# EAGLE design rotenc (EAGLE 9.1.0)
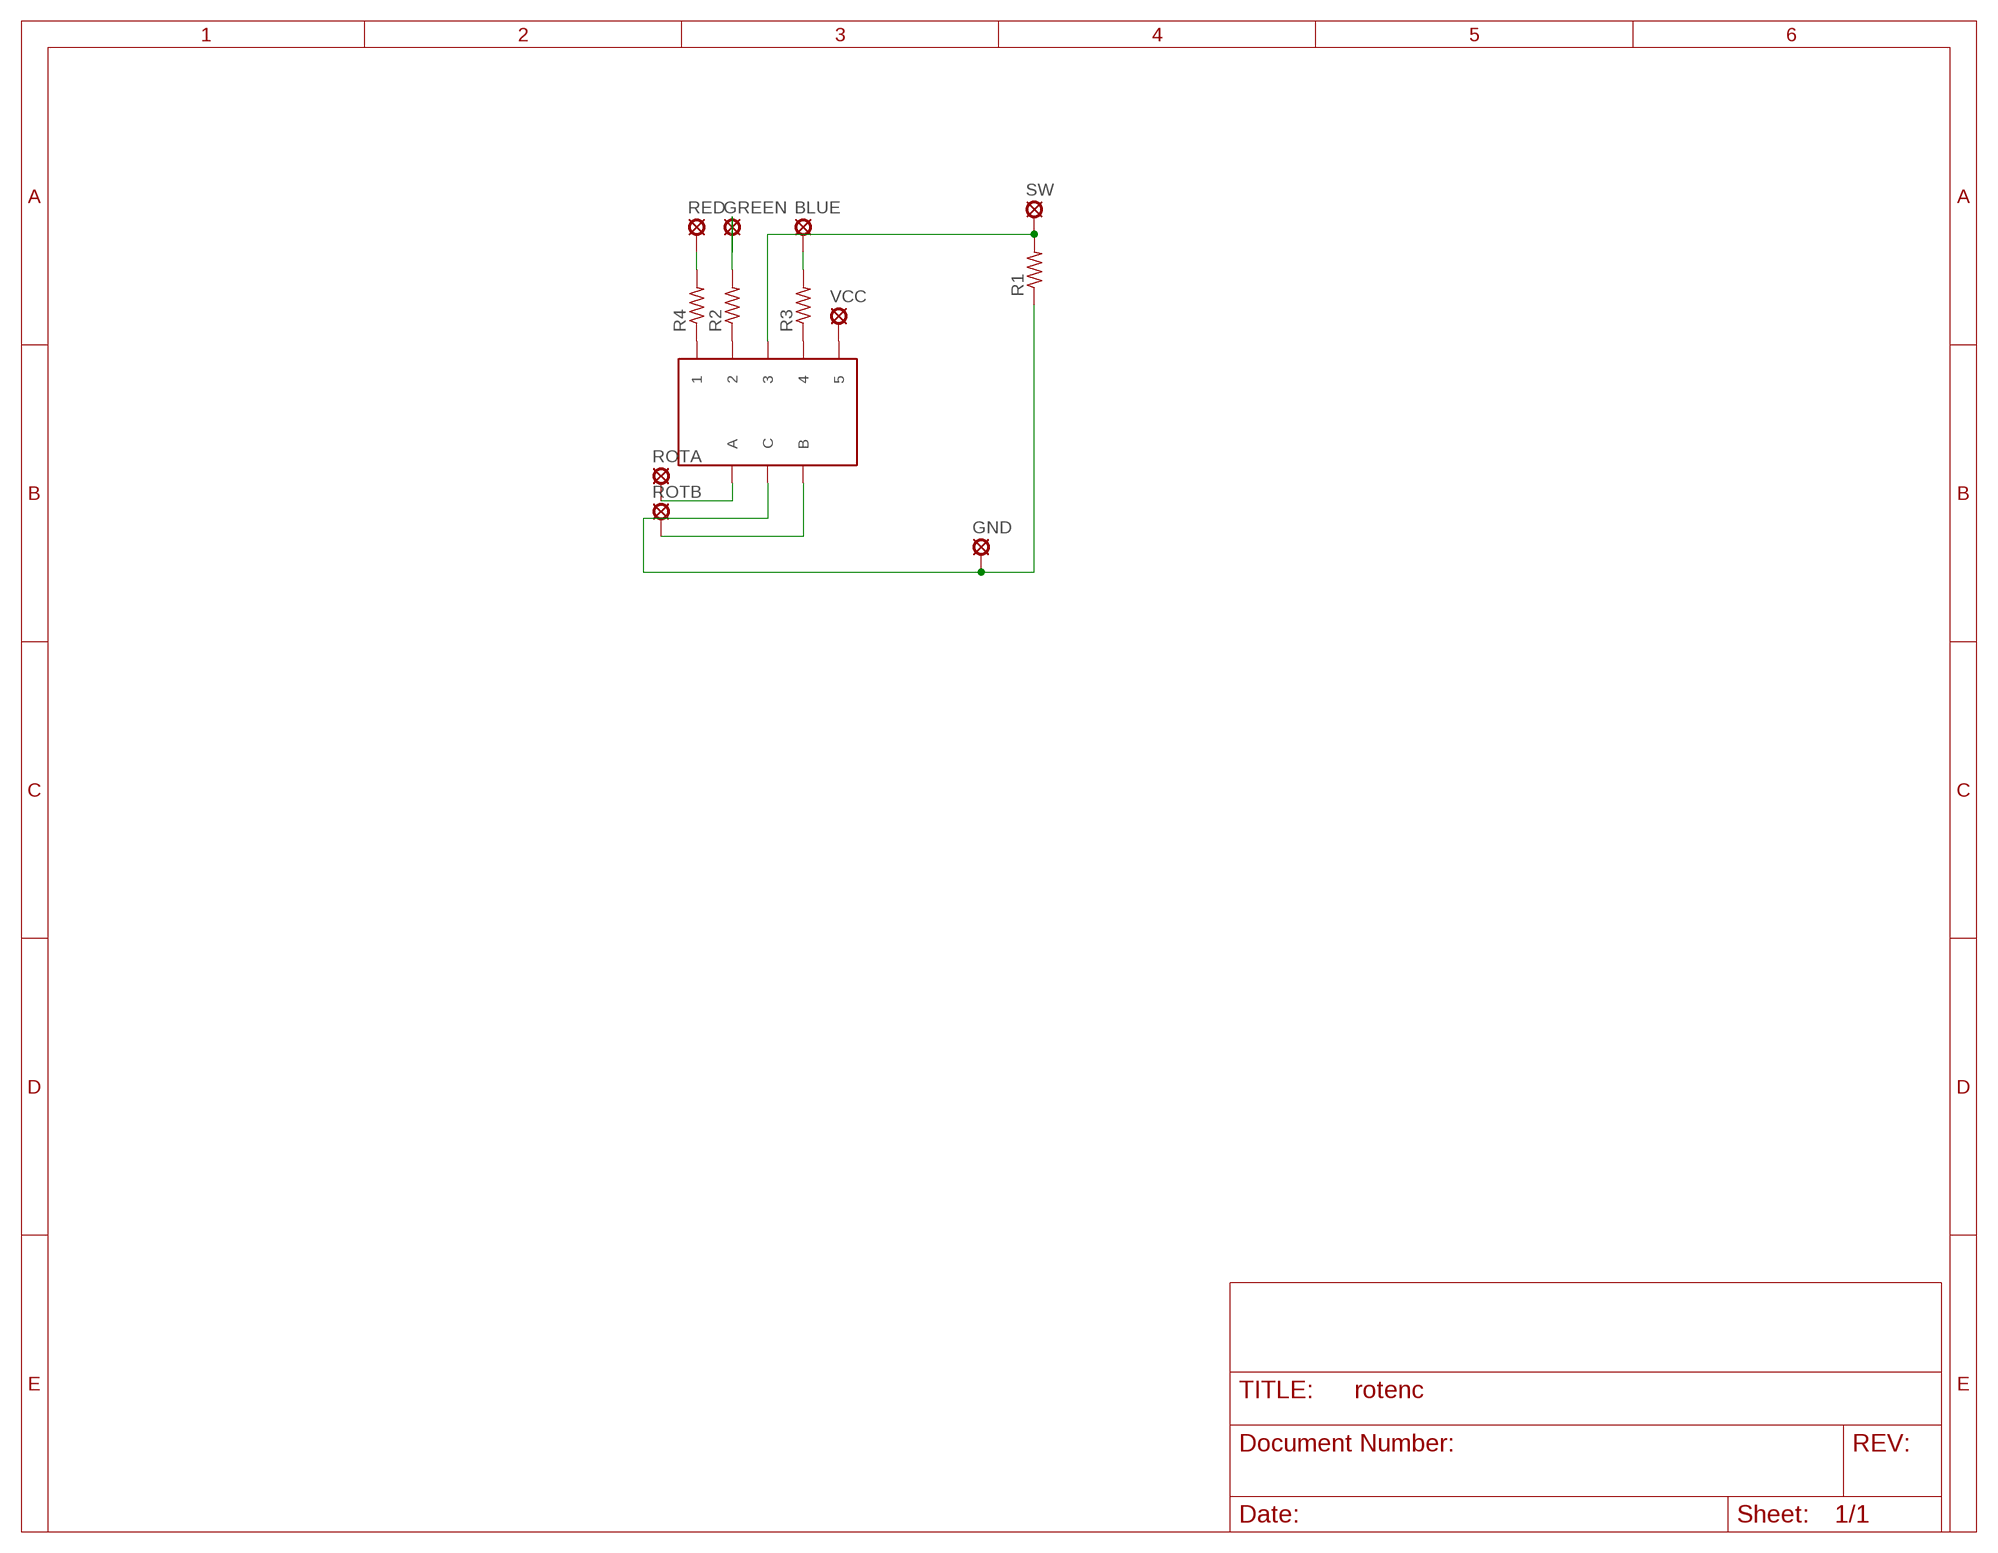
[diagram p0: schematic, sheet 1]

## Parts
BLUE  SE13  [SE13]
GND  SE13  [SE13]
GREEN  SE13  [SE13]
R1  R-US_0207/7  [0207/7]
R2  R-US_0207/7  [0207/7]
R3  R-US_0207/7  [0207/7]
R4  R-US_0207/7  [0207/7]
RED  SE13  [SE13]
ROTA  SE13  [SE13]
ROTB  SE13  [SE13]
SW  SE13  [SE13]
U$1  EC12PLRGB  [EL1296RGB]
VCC  SE13  [SE13]

## Nets
BLUE: BLUE.MP R3.2
GREEN: GREEN.MP R2.2
N$1: R2.1 U$1.2
N$2: R4.1 U$1.1
N$3: R3.1 U$1.4
N$4: U$1.5 VCC.MP
N$5: GND.MP R1.1 U$1.C
RED: R4.2 RED.MP
ROTA: ROTA.MP U$1.A
ROTB: ROTB.MP U$1.B
SW: R1.2 SW.MP U$1.3

## Library data of the parts
BLUE GND GREEN RED ROTA ROTB SW VCC = solpad:SE13: SOLDER PAD E1542, drill 1,3mm, distributor Buerklin, 07F815
R1-R4 = resistor:R-US_: RESISTOR, American symbol
U$1 = EC12:EC12PLRGB

## Board
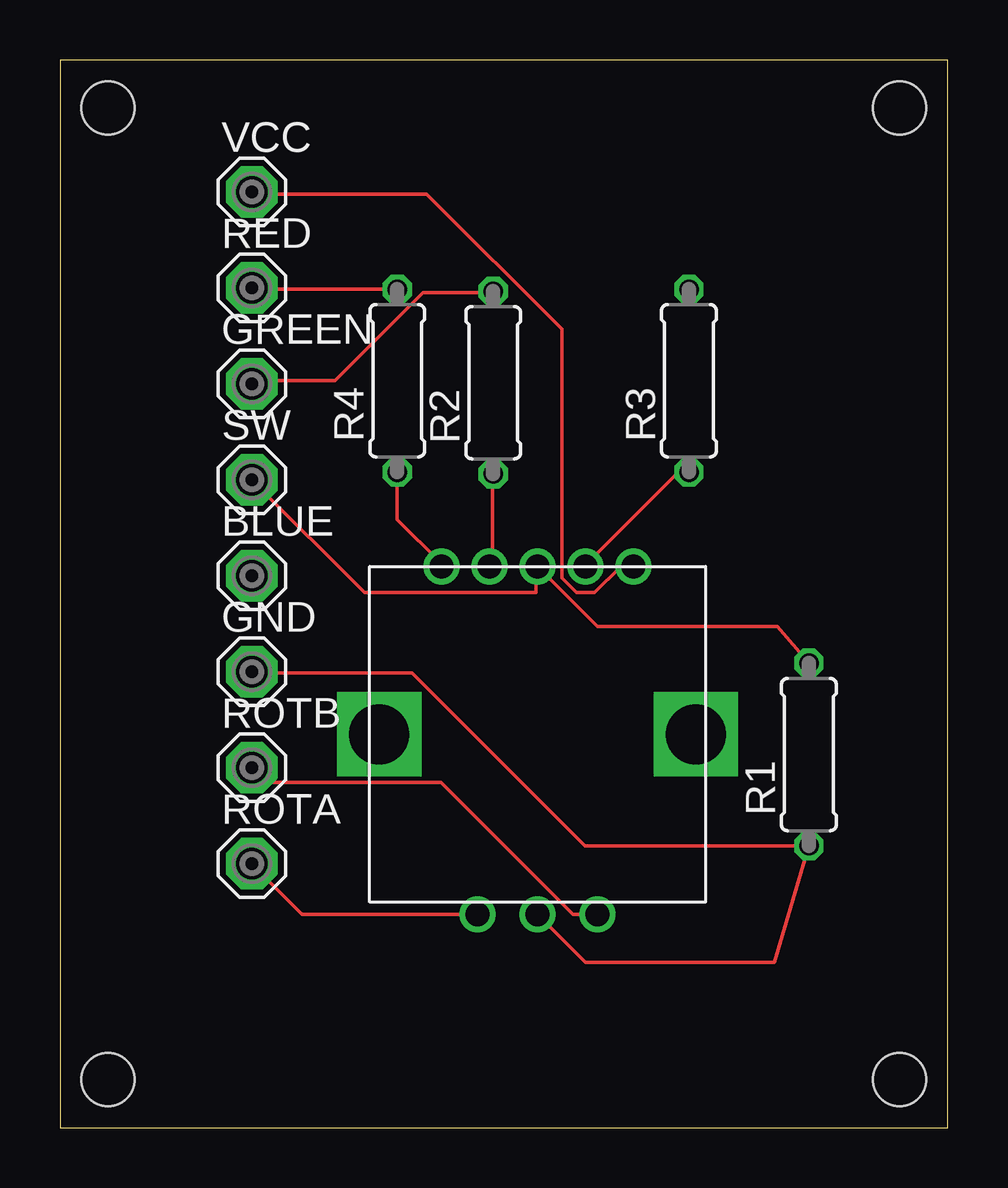
[diagram p1: board, top side]
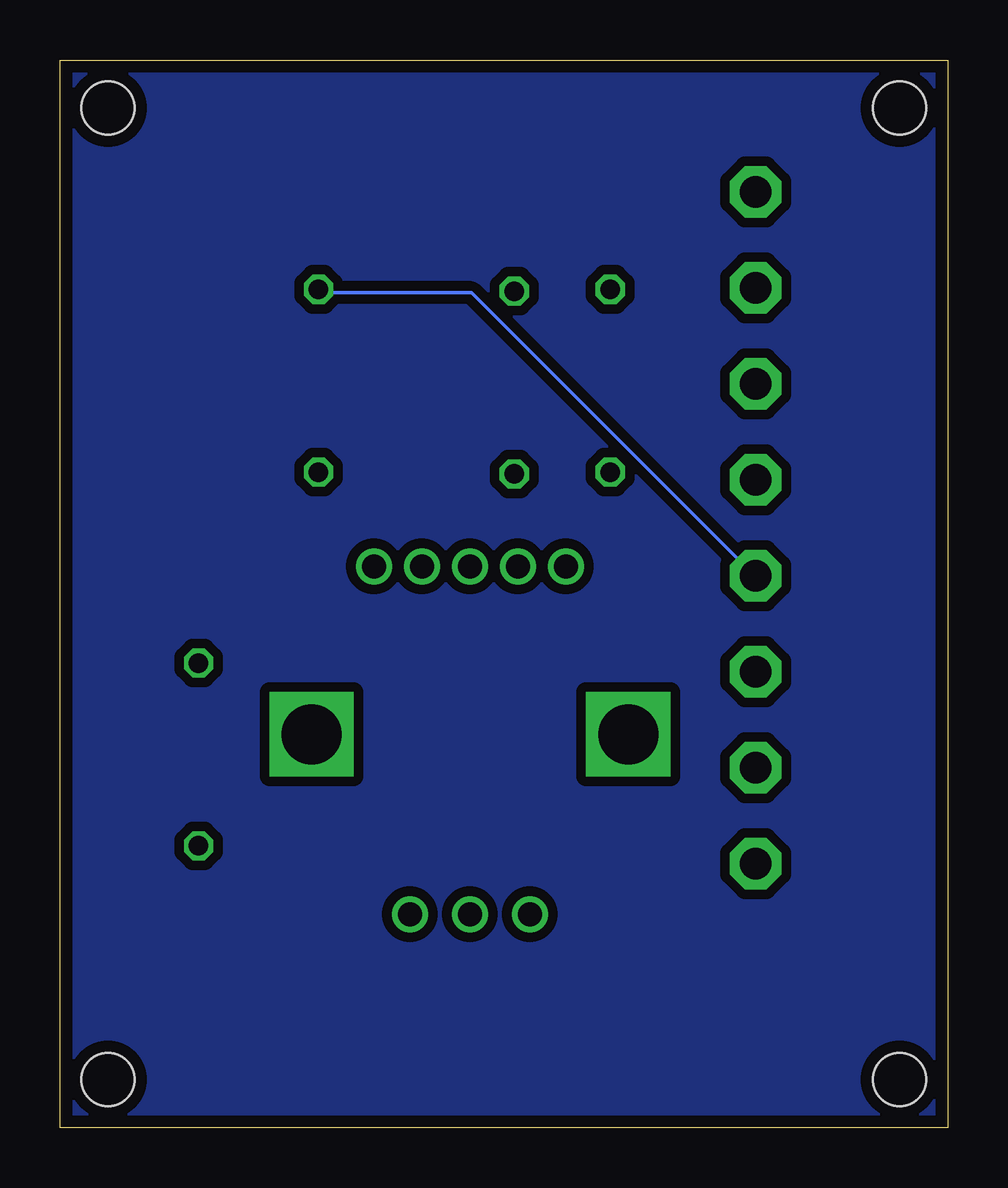
[diagram p2: board, bottom side, seen from below]

Size 37 x 44.5 mm. Coordinates in mm from the lower left corner, seen from the top.
Outline: 0,0 37,0 37,44.5 0,44.5 0,0
Copper layers (1*16): Top 0.035mm / dielectric 1.6mm / Bottom 0.035mm
Design rules "Elecrow_2-layer_PCB_eagle_rule": minimum track width 6mil, minimum drill 12mil, track to track 6mil, track to pad 6mil, pad to pad 6mil, via to via 8mil, smd to smd 0mil, copper to edge 20mil, drill to drill 10mil, minimum pad ring 6mil, minimum via ring 6mil, stop-mask expansion 0mil, vias tented up to drill 100mil, thermal gap 10mil
Holes 2.2 mm at 2,42.5 2,2 35,2 35,42.5

### Footprints (pad centres in the part's own frame; a part is rotated, then mirrored left to right if it is on the bottom)
SE13 = drill 1.321 pad 2.159 octagon: MP 0,0
0207/7 = drill 0.813 octagon: 1 -3.81,0; 2 3.81,0
EL1296RGB = drill 1: 1 -4,7; 2 -2,7; 3 0,7; 4 2,7; 5 4,7; A -2.5,-7.5; B 2.5,-7.5; C 0,-7.5 | drill 2.5 square: HOUSING1 6.6,0; HOUSING2 -6.6,0

### Placement (x,y rotation side)
BLUE  8,23 0 top
GND  8,19 0 top
GREEN  8,31 0 top
R1  31.22,15.55 90 top
R2  18.06,31.05 90 top
R3  26.22,31.13 90 top
R4  14.06,31.13 90 top
RED  8,35 0 top
ROTA  8,11 0 top
ROTB  8,15 0 top
SW  8,27 0 top
U$1  19.91,16.39 0 top
VCC  8,39 0 top

### Tracks (layer width: path | path; a pad name or v marks a point on that pad's centre or on a via)
BLUE
  Bottom 0.152: R3.2 26.1,34.8 19.85,34.8 8.12,23.06 BLUE.MP
GND
  pour Bottom (isolate 0.406, no thermals): 0,44.5 37,44.5 37,0 0,0
GREEN
  Top 0.152: R2.2 18.02,34.8 15.13,34.8 11.47,31.14 8.12,31.14 GREEN.MP
N$1
  Top 0.152: R2.1 18.02,27.18 18.02,23.52 U$1.2
N$2
  Top 0.152: R4.1 14.06,27.18 14.06,25.35 15.89,23.52 U$1.1
N$3
  Top 0.152: R3.1 26.1,27.18 25.64,27.18 21.98,23.52 U$1.4
N$4
  Top 0.152: U$1.5 23.81,23.37 23.36,23.37 22.29,22.3 21.53,22.3 20.92,22.91 20.92,33.28 15.28,38.91 8.12,38.91 VCC.MP
N$5
  Top 0.152: GND.MP 8.12,18.95 14.67,18.95 21.88,11.74 R1.1 29.79,6.89 21.91,6.89 U$1.C
RED
  Top 0.152: R4.2 13.91,34.95 8.12,34.95 RED.MP
ROTA
  Top 0.152: U$1.A 17.26,8.89 10.1,8.89 8.12,10.87 ROTA.MP
ROTB
  Top 0.152: U$1.B 22.29,8.89 21.38,8.89 15.89,14.38 8.73,14.38 8.12,14.99 ROTB.MP
SW
  Top 0.152: R1.2 29.9,20.89 22.41,20.89 U$1.3 19.85,23.37 19.85,22.3 12.69,22.3 8.12,26.87 SW.MP